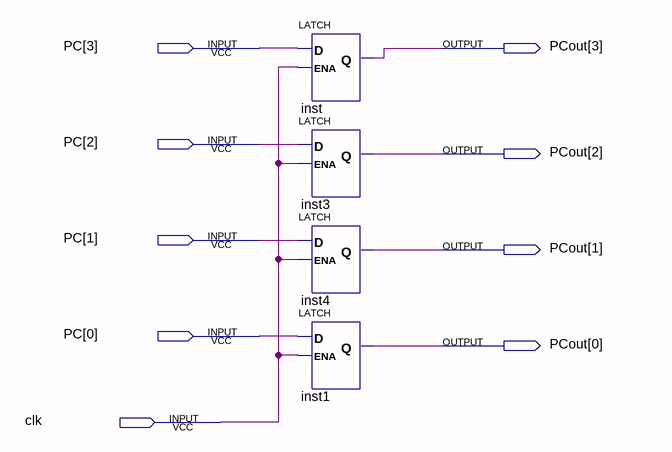
[diagram p0: schematic sheet]
// Quartus schematic PC.bdf as structural Verilog: 4 symbols, 9 pins
module PC (
  input  [3:0] PC,
  input  clk,
  output [3:0] PCout
);

  LATCH inst (.D(PC[3]), .ENA(clk), .Q(PCout[3]));
  LATCH inst3 (.D(PC[2]), .ENA(clk), .Q(PCout[2]));
  LATCH inst4 (.D(PC[1]), .ENA(clk), .Q(PCout[1]));
  LATCH inst1 (.D(PC[0]), .ENA(clk), .Q(PCout[0]));
endmodule
